# EAGLE schematic motherboard (EAGLE 8.0.1)
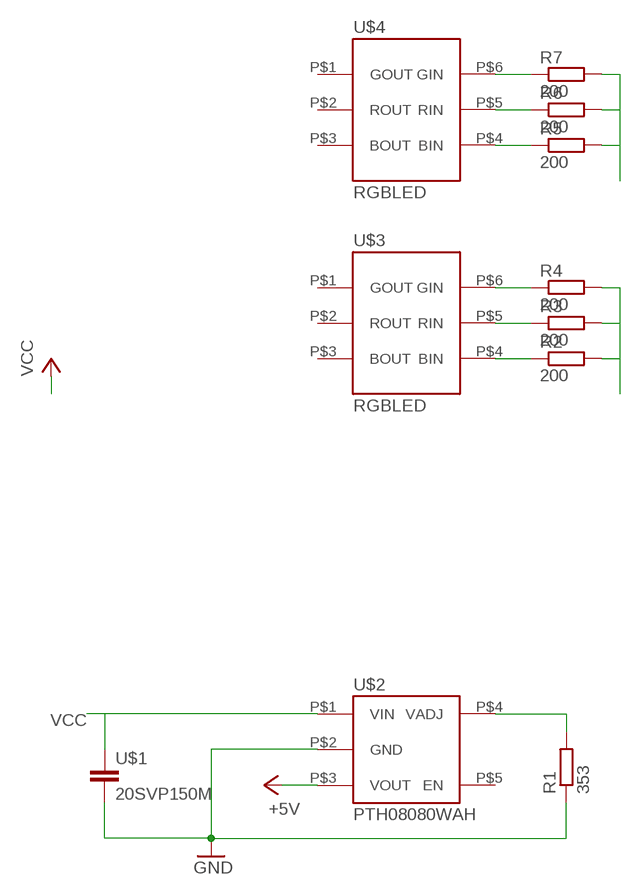
[diagram p0: schematic, sheet 1]

## Parts
R1  353  R-EU_R0805  [R0805]
R2  200  R-EU_R0805  [R0805]
R3  200  R-EU_R0805  [R0805]
R4  200  R-EU_R0805  [R0805]
R5  200  R-EU_R0805  [R0805]
R6  200  R-EU_R0805  [R0805]
R7  200  R-EU_R0805  [R0805]
U$1  20SVP150M  [20SVP150M]
U$2  PTH08080WAH  [PTH08080WAH]
U$3  RGBLED  [RGBLED]
U$4  RGBLED  [RGBLED]

## Nets
+5V: U$2.P$3(VOUT)
GND: R1.1 U$1.P$1 U$2.P$2(GND)
N$2: R5.1 U$4.P$4(BIN)
N$3: R1.2 U$2.P$4(VADJ)
N$4: R6.1 U$4.P$5(RIN)
N$5: R7.1 U$4.P$6(GIN)
N$6: R4.1 U$3.P$6(GIN)
N$7: R3.1 U$3.P$5(RIN)
N$8: R2.1 U$3.P$4(BIN)
N$9: R2.2 R3.2 R4.2
N$10: R5.2 R6.2 R7.2
VCC: U$1.P$2 U$2.P$1(VIN)
Unconnected: U$2.P$5(EN) U$3.P$1(GOUT) U$3.P$2(ROUT) U$3.P$3(BOUT) U$4.P$1(GOUT) U$4.P$2(ROUT) U$4.P$3(BOUT)

## Library data of the parts
R1-R7 = rcl:R-EU_: RESISTOR, European symbol
U$1 = swarmbot:20SVP150M
U$2 = swarmbot:PTH08080WAH
U$3 U$4 = swarmbot:RGBLED